# EAGLE design MRCS-cpNode-ProMini (EAGLE 7.7.0)
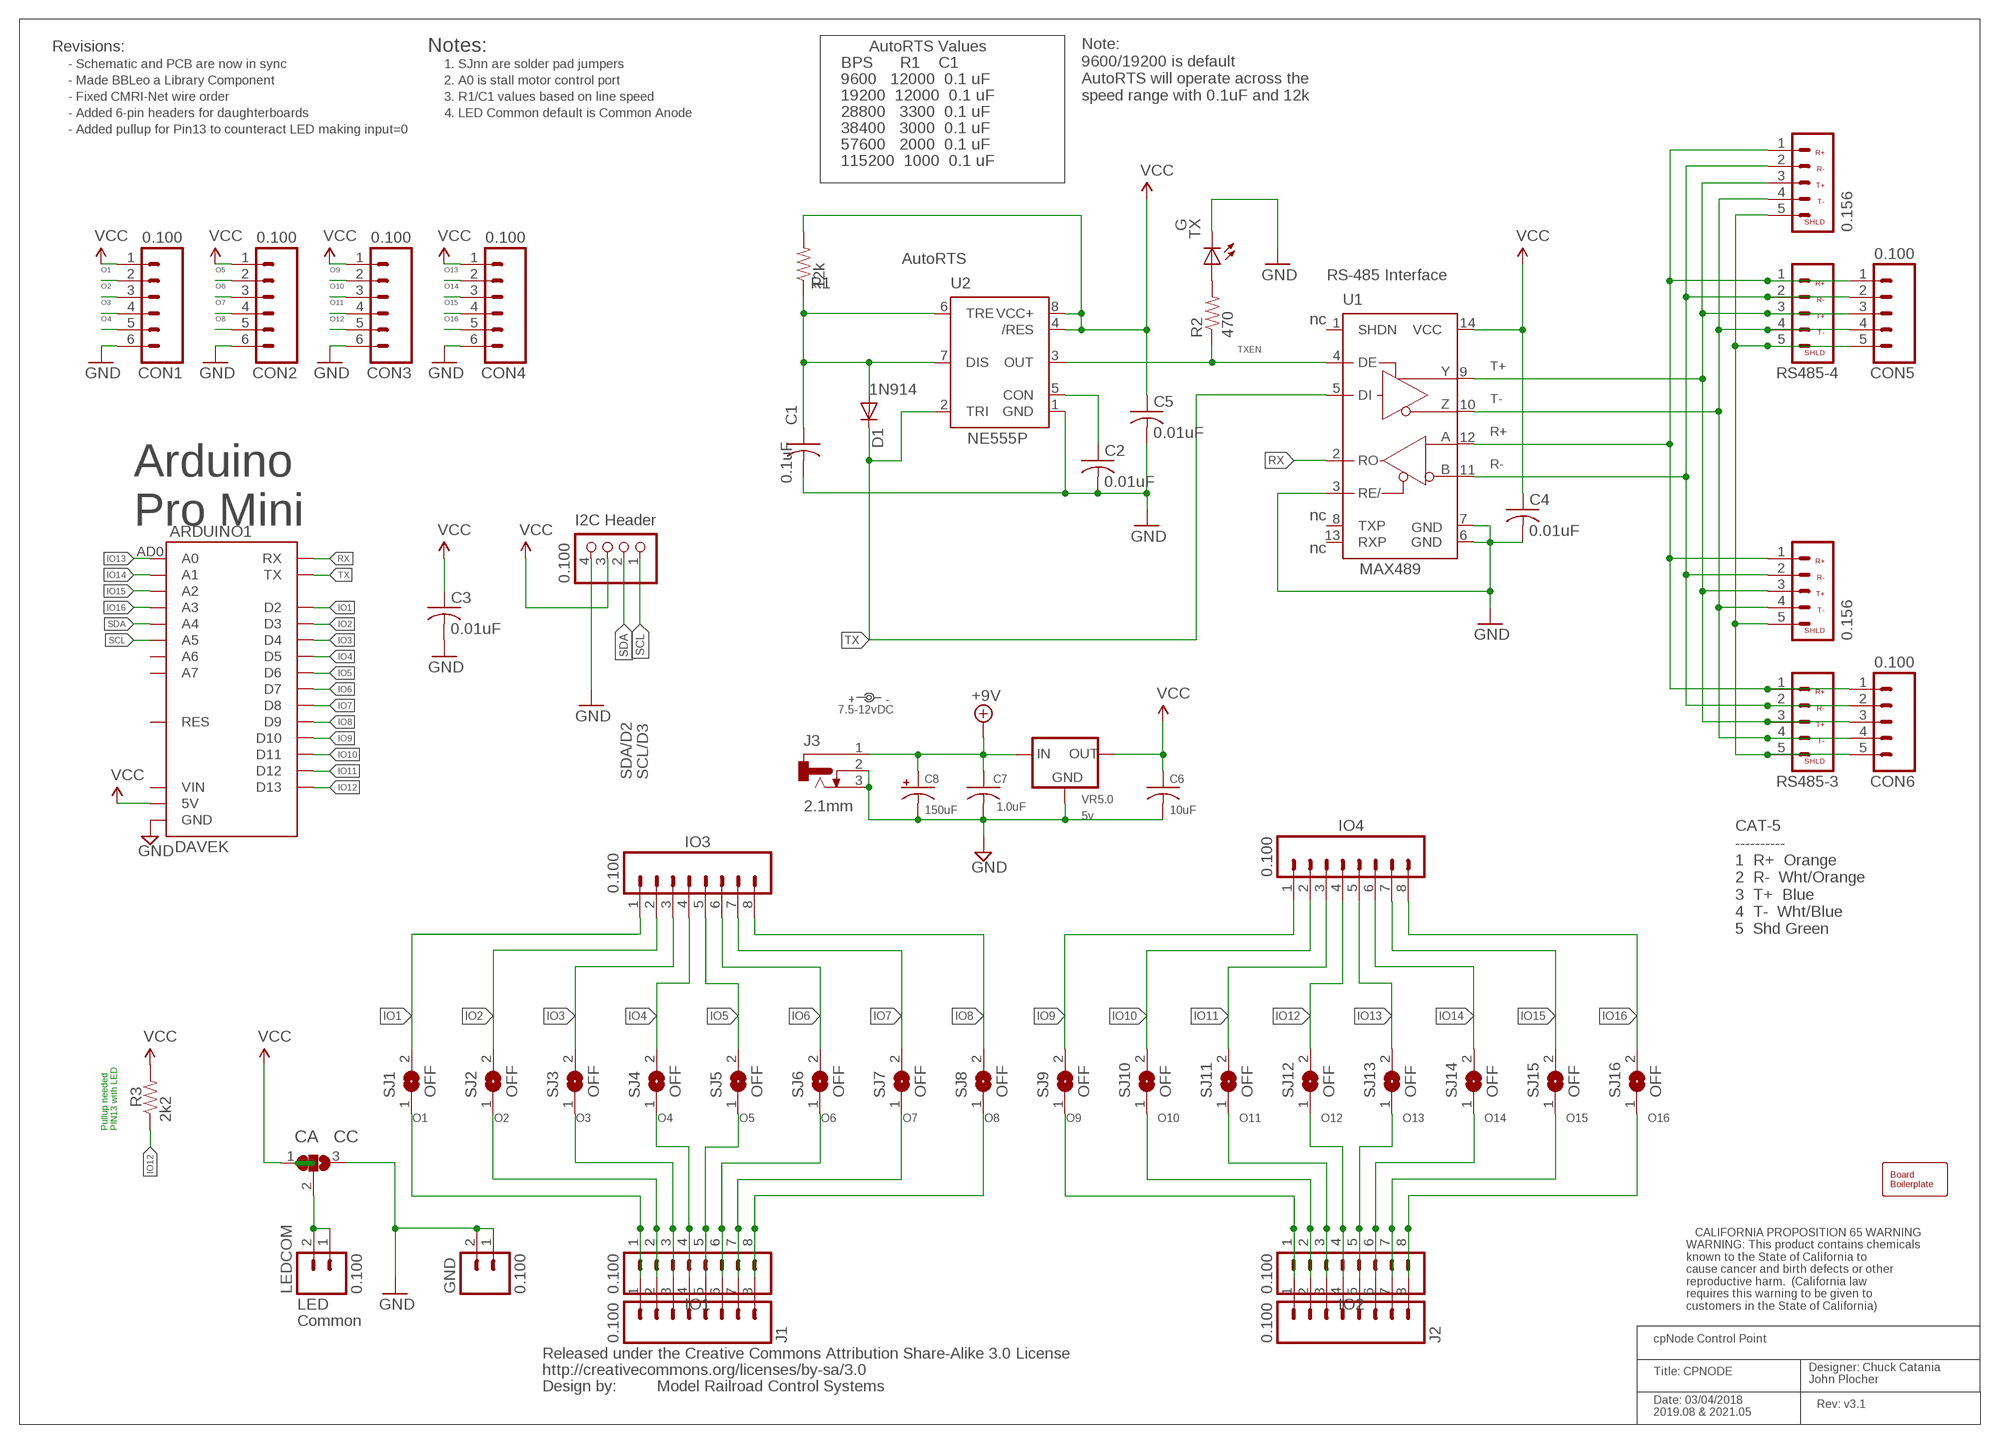
[diagram p0: schematic, sheet 1]

## Parts
ARDUINO1  DAVEK  ARDUINO-PRO-MINIDAVESROBOT  [ARDUINO_PRO_MINI_DAVEK]
BOARD1  BOARD  BOARD69X100MRCS  [BOARD-DINRAIL-2.71IN-MRCS]
C1  0.1uF  CAPPTH2  [C-PTH-0.100]
C2  0.01uF  CAPPTH2  [C-PTH-0.100]
C3  0.01uF  CAPPTH2  [C-PTH-0.100]
C4  0.01uF  CAPPTH2  [C-PTH-0.100]
C5  0.01uF  CAPPTH2  [C-PTH-0.100]
C6  10uF  CAPPTH1  [C050-024X044]
C7  1.0uF  CAPPTH1  [C050-024X044]
C8  150uF  CAP-POLPTH-5MM  [E5-10.5]
CON1  0.100  CONNECTOR-M06SIP_LOCK  [1X06-SIP_LOCK]
CON2  0.100  CONNECTOR-M06SIP_LOCK  [1X06-SIP_LOCK]
CON3  0.100  CONNECTOR-M06SIP_LOCK  [1X06-SIP_LOCK]
CON4  0.100  CONNECTOR-M06SIP_LOCK  [1X06-SIP_LOCK]
CON5  0.100  CONNECTOR-M05LOCK  [1X05_LOCK]
CON6  0.100  CONNECTOR-M05LOCK  [1X05_LOCK]
D1  1N4148  DIODE1N4148  [DIODE-1N4148]
GND  0.100  M02POLAR_LOCK  [MOLEX-1X2_LOCK]
I2CHDR  0.100  PINHD-1X4/90  [1X04/90]
IO1  0.100  M081X08  [1X08]
IO2  0.100  M081X08  [1X08]
IO3  0.100  M081X08  [1X08]
IO4  0.100  M081X08  [1X08]
J1  0.100  CONNECTOR-M08LOCK_LONGPADS  [1X08_LOCK_LONGPADS]
J2  0.100  CONNECTOR-M08LOCK_LONGPADS  [1X08_LOCK_LONGPADS]
J3  2.1mm  CONNECTOR-DC-POWER-RA  [DCJ0202]
LABEL1  7.5-12vDC  DOC-POWER_LABEL  [PWR_LABEL]
LEDCOM  0.100  M02POLAR_LOCK  [MOLEX-1X2_LOCK]
P1  CA CC  PAD-SOLDERJUMPER-2WAYT  [3P-SMD-2X4.8]
R1  12k  RPTH04  [AXIAL-0.4-RES]
R2  470  RPTH04  [AXIAL-0.4-RES]
R3  2k2  RPTH04  [AXIAL-0.4-RES]
RS485-1  0.156  CONNECTOR-CMRINET.156  [KK-156-5]
RS485-2  0.156  CONNECTOR-CMRINET.156  [KK-156-5]
RS485-3  3.5mm  CONNECTOR-CMRINET3.5MM  [CMRINET-3.5MM]
RS485-4  3.5mm  CONNECTOR-CMRINET3.5MM  [CMRINET-3.5MM]
SJ1  OFF  SJ  [SJ]
SJ2  OFF  SJ  [SJ]
SJ3  OFF  SJ  [SJ]
SJ4  OFF  SJ  [SJ]
SJ5  OFF  SJ  [SJ]
SJ6  OFF  SJ  [SJ]
SJ7  OFF  SJ  [SJ]
SJ8  OFF  SJ  [SJ]
SJ9  OFF  SJ  [SJ]
SJ10  OFF  SJ  [SJ]
SJ11  OFF  SJ  [SJ]
SJ12  OFF  SJ  [SJ]
SJ13  OFF  SJ  [SJ]
SJ14  OFF  SJ  [SJ]
SJ15  OFF  SJ  [SJ]
SJ16  OFF  SJ  [SJ]
TX  G  LEDLED3MM  [LED3MM]
U1  MAX3465CPD  [DIL14]
U2  NE555P  [DIL-08]
U$1  CREATIVE_COMMONS  [CREATIVE_COMMONS]
U$2  Prop65  CA-PROP65WARNING  [CA-PROP65WARNING]
VR5.0  5v  VREG-PTH-RA-  [TO-220-RA]

## Nets
+9V [Feed]: C7.1 C8.+ J3.1 VR5.0.IN
GND: ARDUINO1.GND@1(GND) ARDUINO1.GND@2(GND) ARDUINO1.GND@4(GND) C1.2 C2.2 C3.2 C4.2 C5.2 C6.2 C7.2 C8.- CON1.6 CON2.6 CON3.6 CON4.6 GND.1 GND.2 I2CHDR.4 J3.2 J3.3 P1.3 TX.K(C) U1.3(RE/) U1.6(GND) U1.7(GND) U2.1(GND) VR5.0.GND
IO1: ARDUINO1.D2 IO3.1 SJ1.2
IO2: ARDUINO1.D3 IO3.2 SJ2.2
IO3: ARDUINO1.D4 IO3.3 SJ3.2
IO4: ARDUINO1.D5 IO3.4 SJ4.2
IO5: ARDUINO1.D6 IO3.5 SJ5.2
IO6: ARDUINO1.D7 IO3.6 SJ6.2
IO7: ARDUINO1.D8 IO3.7 SJ7.2
IO8: ARDUINO1.D9 IO3.8 SJ8.2
IO9: ARDUINO1.D10 IO4.1 SJ9.2
IO10: ARDUINO1.D11 IO4.2 SJ10.2
IO11: ARDUINO1.D12 IO4.3 SJ11.2
IO12: ARDUINO1.D13 IO4.4 R3.P$1 SJ12.2
IO13: ARDUINO1.AD0(A0) IO4.5 SJ13.2
IO14: ARDUINO1.AD1(A1) IO4.6 SJ14.2
IO15: ARDUINO1.AD2(A2) IO4.7 SJ15.2
IO16: ARDUINO1.AD3(A3) IO4.8 SJ16.2
N$29: R2.P$2 TX.A
N$38: C2.1 U2.5(CON)
N$45: LEDCOM.1 LEDCOM.2 P1.2
N$52: C1.1 D1.A R1.P$1 U2.6(TRE) U2.7(DIS)
O1: CON1.2 IO1.1 J1.1 SJ1.1
O2: CON1.3 IO1.2 J1.2 SJ2.1
O3: CON1.4 IO1.3 J1.3 SJ3.1
O4: CON1.5 IO1.4 J1.4 SJ4.1
O5: CON2.2 IO1.5 J1.5 SJ5.1
O6: CON2.3 IO1.6 J1.6 SJ6.1
O7: CON2.4 IO1.7 J1.7 SJ7.1
O8: CON2.5 IO1.8 J1.8 SJ8.1
O9: CON3.2 IO2.1 J2.1 SJ9.1
O10: CON3.3 IO2.2 J2.2 SJ10.1
O11: CON3.4 IO2.3 J2.3 SJ11.1
O12: CON3.5 IO2.4 J2.4 SJ12.1
O13: CON4.2 IO2.5 J2.5 SJ13.1
O14: CON4.3 IO2.6 J2.6 SJ14.1
O15: CON4.4 IO2.7 J2.7 SJ15.1
O16: CON4.5 IO2.8 J2.8 SJ16.1
R+: CON5.1 CON6.1 RS485-1.1 RS485-2.1 RS485-3.1 RS485-4.1 U1.12(A)
R-: CON5.2 CON6.2 RS485-1.2 RS485-2.2 RS485-3.2 RS485-4.2 U1.11(B)
RX: ARDUINO1.RX U1.2(RO)
SCL [signals]: ARDUINO1.AD5(A5) I2CHDR.1
SDA [signals]: ARDUINO1.AD4(A4) I2CHDR.2
SHIELD: CON5.5 CON6.5 RS485-1.5 RS485-2.5 RS485-3.5 RS485-4.5
T+: CON5.3 CON6.3 RS485-1.3 RS485-2.3 RS485-3.3 RS485-4.3 U1.9(Y)
T-: CON5.4 CON6.4 RS485-1.4 RS485-2.4 RS485-3.4 RS485-4.4 U1.10(Z)
TX: ARDUINO1.TX@1(TX) D1.C U1.5(DI) U2.2(TRI)
TXEN: R2.P$1 U1.4(DE) U2.3(OUT)
VCC: ARDUINO1.5V C3.1 C4.1 C5.1 C6.1 CON1.1 CON2.1 CON3.1 CON4.1 I2CHDR.3 P1.1 R1.P$2 R3.P$2 U1.14(VCC) U2.4(/RES) U2.8(VCC+) VR5.0.OUT
Unconnected: ARDUINO1.AD6(A6) ARDUINO1.AD7(A7) ARDUINO1.RES ARDUINO1.RES@1(RES) ARDUINO1.VIN U1.1(SHDN) U1.8(TXP) U1.13(RXP)

## Notes on the sheet
- Revisions: | Notes: | AutoRTS Values
- - Schematic and PCB are now in sync | 1. SJnn are solder pad jumpers | BPS      R1    C1
- - Made BBLeo a Library Component | 2. A0 is stall motor control port | 9600   12000  0.1 uF
- - Fixed CMRI-Net wire order | 3. R1/C1 values based on line speed | 19200  12000  0.1 uF
- Note: 
  9600/19200 is default
  AutoRTS will operate across the
  speed range with 0.1uF and 12k
- - Added 6-pin headers for daughterboards | 4. LED Common default is Common Anode | 28800   3300  0.1 uF
- - Added pullup for Pin13 to counteract LED making input=0 | 38400   3000  0.1 uF
- 57600   2000  0.1 uF
- 115200  1000  0.1 uF
- AutoRTS
- RS-485 Interface
- nc
- T+
- 1N914
- T-
- R+
- R-
- nc
- Arduino
  Pro Mini
- I2C Header
- nc
- MAX489
- SDA/D2 | SCL/D3
- CAT-5
  ----------
  1  R+  Orange
  2  R-  Wht/Orange
  3  T+  Blue
  4  T-  Wht/Blue
  5  Shd Green
- Pullup needed
  PIN13 with LED
- LED
- Common
- cpNode Control Point
- Title: CPNODE
- Designer: Chuck Catania
  John Plocher
- Model Railroad Control Systems
- Rev: v3.1
- Date: 03/04/2018
  2019.08 & 2021.05

## Library data of the parts
ARDUINO1 = SPCoast:ARDUINO-PRO-MINI
BOARD1 = SPCoast:BOARD
C1-C7 = SPCoast:CAP*
C8 = SPCoast:CAP-POL*
CON1-CON4 = SPCoast:CONNECTOR-M06: Header 6 Standard 6-pin 0.1" header
CON5 CON6 = SPCoast:CONNECTOR-M05: Header 5 Standard 5-pin 0.1" header. Use with straight break away headers (SKU : PRT-00116), right angle break away headers (PRT-00553), swiss pins (PRT-00743), machine pins (PRT-00117), and female headers (PRT-00115). Molex polarized connector foot print use with SKU : PRT-08230 with associated crimp pins and housings.
D1 = SPCoast:DIODE: Diode These are standard reverse protection diodes and small signal diodes. SMA package can handle up to about 1A. SOD-323 can handle about 200mA. What the SOD-323 package when ordering, there are some mfgs out there that are 5-pin packages.
GND LEDCOM = SparkFun:M02: Header 2 Standard 2-pin 0.1" header. Use with straight break away headers (SKU : PRT-00116), right angle break away headers (PRT-00553), swiss pins (PRT-00743), machine pins (PRT-00117), and female headers (PRT-00115). Molex polarized connector foot print use with SKU : PRT-08233 with associated crimp pins and housings.
I2CHDR = pinhead:PINHD-1X4: PIN HEADER
IO1-IO4 = SparkFun:M08: Header 8 Standard 8-pin 0.1" header. Use with straight break away headers (SKU : PRT-00116), right angle break away headers (PRT-00553), swiss pins (PRT-00743), machine pins (PRT-00117), and female headers (PRT-00115).
J1 J2 = SPCoast:CONNECTOR-M08: Header 8 Standard 8-pin 0.1" header. Use with straight break away headers (SKU : PRT-00116), right angle break away headers (PRT-00553), swiss pins (PRT-00743), machine pins (PRT-00117), and female headers (PRT-00115).
J3 = SPCoast:CONNECTOR-DC-POWER: DC POWER JACK
LABEL1 = SPCoast:DOC-POWER_LABEL
P1 = Discreter:PAD-SOLDERJUMPER-2WAY: Solder Jumper 2 way solder jumper
R1-R3 = SPCoast:R*: Resistor Basic schematic elements and footprints for 0603, 1206, and PTH 1/10th watt (small) resistors.
RS485-1-RS485-4 = SPCoast:CONNECTOR-CMRINET: CMRINet Top 3.5mm Screw Terminal 5 pos
SJ1-SJ16 = jumper:SJ: SMD solder JUMPER
TX = SPCoast:LED*
U1 = maxim:MAX346*: +5V, Fail-Safe, 40Mbps, Profibus RS-485/RS-422 Transceivers Source: MAX3465-MAX3469.pdf; MPN: MAX3465CPD+; OC_FARNELL: unknown; OC_NEWARK: 42M5444
U2 = SparkFun:NE555: General purpose bipolar Timer; MF: Arrow Electronics; MPN: NE555N; OC_FARNELL: 1467742; OC_NEWARK: 89K1486
U$1 = SparkFun:CREATIVE_COMMONS
U$2 = MRCS-prop65warningTop:CA-PROP65WARNING: CALIFORNIA PROPOSITION 65 WARNING
VR5.0 = SPCoast:VREG-?-*: Voltage Regulator Standard linear regulator. 7805 uses IGO pinout LM1117 uses GOI pinout

## Net classes
0 default: width 0.254 mm, drill 0.5 mm, clearance 0.203 mm
1 Power: width 0.254 mm, drill 0.8 mm, clearance 0.254 mm
2 signals: width 0.254 mm, drill 0.6 mm, clearance 0.254 mm
3 Feed: width 0.762 mm, drill 1.4 mm, clearance 0.254 mm

## Board
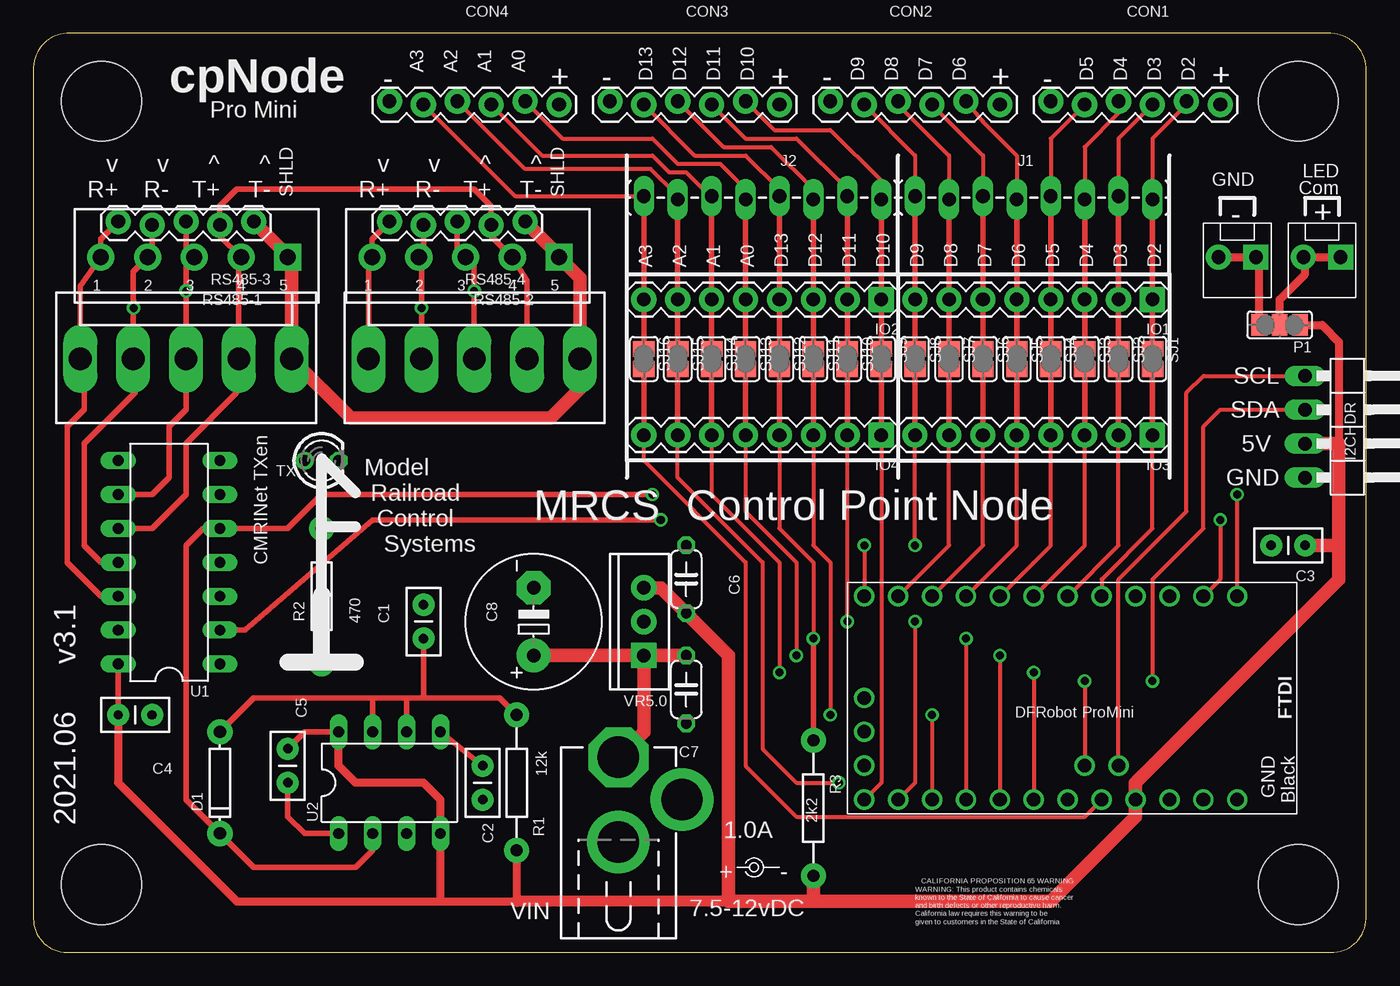
[diagram p1: board, top side]
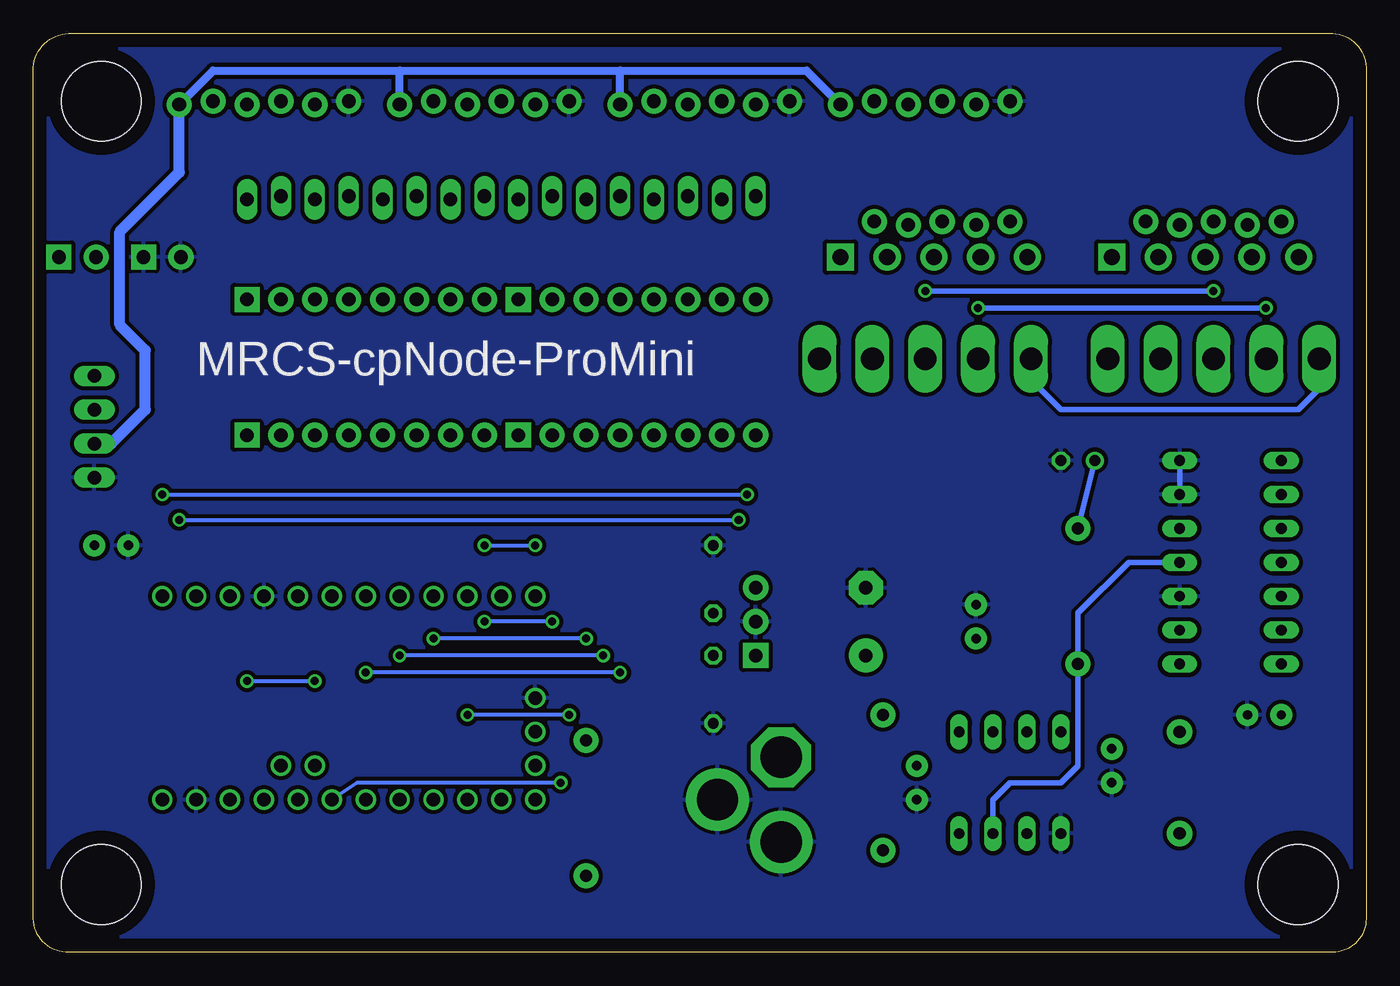
[diagram p2: board, bottom side, seen from below]

Size 99.82 x 68.83 mm. Coordinates in mm from the lower left corner, seen from the top.
Copper layers (1*16): Top 0.035mm / dielectric 1.5mm / Bottom 0.035mm
Design rules "default": minimum track width 10mil, minimum drill 0.6mm, track to track 8mil, track to pad 8mil, pad to pad 8mil, via to via 8mil, smd to smd 8mil, copper to edge 40mil, drill to drill 8mil, minimum pad ring 10mil, minimum via ring 8mil, stop-mask expansion 4mil, vias tented up to drill 0mil, thermal gap 10mil

### Footprints (pad centres in the part's own frame; a part is rotated, then mirrored left to right if it is on the bottom)
ARDUINO_PRO_MINI_DAVEK = drill 1.016: 5V 16.51,21.59; AD0 16.51,11.43; AD1 16.51,13.97; AD2 16.51,16.51; AD3 16.51,19.05; AD4 13.97,17.78; AD5 13.97,20.32; AD6 11.43,1.27; AD7 13.97,1.27; D2 1.27,19.05; D3 1.27,16.51; D4 1.27,13.97; D5 1.27,11.43; D6 1.27,8.89; D7 1.27,6.35; D8 1.27,3.81; D9 1.27,1.27; D10 16.51,1.27; D11 16.51,3.81; D12 16.51,6.35; D13 16.51,8.89; GND@1 16.51,26.67; GND@2 8.89,1.27; GND@4 1.27,21.59; RES 16.51,24.13; RES@1 1.27,24.13; RX 1.27,26.67; TX@1 1.27,29.21; VIN 16.51,29.21
BOARD-DINRAIL-2.71IN-MRCS = hole 6: 94.742,5.08; 5.08,63.754; 94.742,63.754; 5.08,5.08
C-PTH-0.100 = drill 0.7 pad 1.651: 1 -1.27,0; 2 1.27,0
C050-024X044 = drill 0.813 octagon: 1 -2.54,0; 2 2.54,0
E5-10.5 = drill 1.016 pad 2.54: + -2.54,0 | drill 1.016 pad 2.54 octagon: - 2.54,0
1X06-SIP_LOCK = drill 1.016 pad 1.88: 1 0,0; 2 2.54,-0.254; 3 5.08,0; 4 7.62,-0.254; 5 10.16,0; 6 12.7,-0.254
1X05_LOCK = drill 1.016 pad 1.88: 1 0,0.127; 2 2.54,-0.127; 3 5.08,0.127; 4 7.62,-0.127; 5 10.16,0.127
DIODE-1N4148 = drill 0.9 pad 1.88: A 3.81,0; C -3.81,0
MOLEX-1X2_LOCK = drill 1.016 pad 1.88 square: 1 -0.127,0 | drill 1.016 pad 1.88: 2 2.667,0
1X04/90 = drill 1.016 long: 1 -3.81,-3.81; 2 -1.27,-3.81; 3 1.27,-3.81; 4 3.81,-3.81
1X08 = drill 1.016 pad 1.88 square: 1 0,0 | drill 1.016 pad 1.88: 2 2.54,0; 3 5.08,0; 4 7.62,0; 5 10.16,0; 6 12.7,0; 7 15.24,0; 8 17.78,0
1X08_LOCK_LONGPADS = drill 1.016 long: 1 0,0.127; 2 2.54,-0.127; 3 5.08,0.127; 4 7.62,-0.127; 5 10.16,0.127; 6 12.7,-0.127; 7 15.24,0.127; 8 17.78,-0.127
DCJ0202 = drill 3.1 pad 4.5 octagon: 1 0,3.175 | drill 3.1 pad 4.7: 2 4.763,0; 3 0,-3.175
3P-SMD-2X4.8 = smd 1.168 x 1.6: 1 -1.524,0; 2 0,0; 3 1.524,0
AXIAL-0.4-RES = drill 0.9 pad 1.88: P$1 -5.08,0; P$2 5.08,0
KK-156-5 = drill 1.7 pad 2.184 long: 1 -7.92,0; 2 -3.96,0; 3 0,0; 4 3.96,0; 5 7.92,0
CMRINET-3.5MM = drill 1.2 pad 2.032: 1 -6.38,0; 2 -2.88,0; 3 0.62,0; 4 4.12,0 | drill 1.2 pad 2.032 square: 5 7.62,0
SJ = smd 1.168 x 1.6: 1 -0.762,0; 2 0.762,0
LED3MM = drill 0.813: A 1.27,0 | drill 0.813 octagon: K -1.27,0
DIL14 = drill 0.813 long: 1 -7.62,-3.81; 2 -5.08,-3.81; 3 -2.54,-3.81; 4 0,-3.81; 5 2.54,-3.81; 6 5.08,-3.81; 7 7.62,-3.81; 8 7.62,3.81; 9 5.08,3.81; 10 2.54,3.81; 11 0,3.81; 12 -2.54,3.81; 13 -5.08,3.81; 14 -7.62,3.81
DIL-08 = drill 0.813 long: 1 -3.81,-3.81; 2 -1.27,-3.81; 3 1.27,-3.81; 4 3.81,-3.81; 5 3.81,3.81; 6 1.27,3.81; 7 -1.27,3.81; 8 -3.81,3.81
TO-220-RA = drill 1 pad 1.88: GND 0,0; OUT 2.54,0 | drill 1 pad 1.88 square: IN -2.54,0

### Placement (x,y rotation side)
ARDUINO1  60.96,27.94 270 top
BOARD1  0,0 0 top
C1  29.21,24.77 90 top
C2  33.66,12.7 270 top
C3  93.98,30.48 180 top
C4  7.62,17.78 0 top
C5  19.05,13.97 270 top
C6  48.9,27.94 90 top
C7  48.9,19.68 270 top
C8  37.47,24.77 90 top
CON1  88.9,63.5 180 top
CON2  72.39,63.5 180 top
CON3  55.88,63.5 180 top
CON4  39.37,63.5 180 top
CON5  6.35,54.61 0 top
CON6  26.67,54.61 0 top
D1  13.97,12.7 90 top
GND  91.44,52.07 180 top
I2CHDR  99.06,39.37 270 top
IO1  83.82,48.9 180 top
IO2  63.5,48.9 180 top
IO3  83.82,38.73 180 top
IO4  63.5,38.73 180 top
J1  83.82,56.52 180 top
J2  63.5,56.52 180 top
J3  43.82,11.43 0 top
LABEL1  53.98,6.35 90 top
LEDCOM  97.79,52.07 180 top
P1  93.35,46.99 180 top
R1  36.2,12.7 270 top
R2  21.59,26.67 90 top
R3  58.42,10.79 270 top
RS485-1  11.43,44.45 0 top
RS485-2  33.02,44.45 0 top
RS485-3  11.43,52.07 0 top
RS485-4  31.75,52.07 0 top
SJ1  83.82,44.45 270 top
SJ2  81.28,44.45 270 top
SJ3  78.74,44.45 270 top
SJ4  76.2,44.45 270 top
SJ5  73.66,44.45 270 top
SJ6  71.12,44.45 270 top
SJ7  68.58,44.45 270 top
SJ8  66.04,44.45 270 top
SJ9  63.5,44.45 270 top
SJ10  60.96,44.45 270 top
SJ11  58.42,44.45 270 top
SJ12  55.88,44.45 270 top
SJ13  53.34,44.45 270 top
SJ14  50.8,44.45 270 top
SJ15  48.26,44.45 270 top
SJ16  45.72,44.45 270 top
TX  21.59,36.83 180 top
U1  10.16,29.21 90 top
U2  26.67,12.7 0 top
U$1  17.78,-11.43 0 top  (outside the outline)
U$2  72.39,3.81 0 top
U$3  MRCS  [MRCS-LOGO]  21.59,21.72 0 top
VR5.0  45.72,24.77 90 top

### Tracks (layer width: path | path; a pad name or v marks a point on that pad's centre or on a via)
+9V
  Top 1.016: C7.1 VR5.0.IN | J3.1 45.72,16.51 VR5.0.IN | C8.+ VR5.0.IN
GND
  Top 0.406: 91.82,51.69 GND.1 | C5.2 19.05,10.16 20.32,8.89 U2.1
  Top 0.61: GND.2 GND.1 | P1.3 91.82,51.69
  Bottom 0.406: U1.7 U1.6
  pour Bottom (isolate 0.305): 0,68.58 99.7,68.58 99.7,6.99 99.7,0 0,0
IO1
  Top 0.305: IO3.1 83.82,31.75 80.01,27.94 ARDUINO1.D2
  Top 0.406: SJ1.2 IO3.1
IO2
  Top 0.305: IO3.2 81.28,30.48 ARDUINO1.D3
  Top 0.406: SJ2.2 IO3.2
IO3
  Top 0.305: IO3.3 78.74,30.48 ARDUINO1.D4
  Top 0.406: SJ3.2 IO3.3
IO4
  Top 0.305: IO3.4 76.2,30.48 ARDUINO1.D5
  Top 0.406: SJ4.2 IO3.4
IO5
  Top 0.305: IO3.5 73.66,30.48 ARDUINO1.D6
  Top 0.406: IO3.5 SJ5.2
IO6
  Top 0.305: IO3.6 71.12,30.48 ARDUINO1.D7
  Top 0.406: SJ6.2 IO3.6
IO7
  Top 0.305: IO3.7 68.58,30.48 ARDUINO1.D8
  Top 0.406: SJ7.2 IO3.7
IO8  (via drill 0.6)
  Top 0.305: v66.04,30.48 IO3.8 | v62.23,30.48 ARDUINO1.D9
  Top 0.406: SJ8.2 IO3.8
  Bottom 0.305: v66.04,30.48 v62.23,30.48
IO9
  Top 0.305: IO4.1 63.5,12.7 ARDUINO1.D10
  Top 0.406: SJ9.2 IO4.1
IO10  (via drill 0.6)
  Top 0.305: v60.96,24.77 IO4.2 | v66.04,24.77 66.04,12.7 ARDUINO1.D11
  Top 0.406: SJ10.2 IO4.2
  Bottom 0.305: v60.96,24.77 v66.04,24.77
IO11  (via drill 0.6)
  Top 0.305: v67.31,17.78 ARDUINO1.D12 | IO4.3 58.42,30.48 59.69,29.21 v59.69,17.78
  Top 0.406: SJ11.2 IO4.3
  Bottom 0.305: v59.69,17.78 v67.31,17.78
IO12  (via drill 0.6)
  Top 0.305: v69.85,23.5 ARDUINO1.D13 | IO4.4 55.88,31.75 58.42,29.21 v58.42,23.5
  Top 0.406: SJ12.2 IO4.4 | v58.42,23.5 R3.P$1
  Bottom 0.305: v58.42,23.5 v69.85,23.5
IO13  (via drill 0.6)
  Top 0.305: v72.39,22.23 ARDUINO1.AD0 | IO4.5 53.34,33.02 57.15,29.21 v57.15,22.23
  Top 0.406: SJ13.2 IO4.5
  Bottom 0.305: v57.15,22.23 v72.39,22.23
IO14  (via drill 0.6)
  Top 0.305: v74.93,20.95 ARDUINO1.AD1 | IO4.6 50.8,34.29 55.88,29.21 v55.88,20.95
  Top 0.406: SJ14.2 IO4.6
  Bottom 0.305: v55.88,20.95 v74.93,20.95
IO15  (via drill 0.6)
  Top 0.305: IO4.7 48.26,35.56 54.61,29.21 54.61,15.24 57.15,12.7 v60.33,12.7
  Top 0.406: SJ15.2 IO4.7
  Bottom 0.305: v60.33,12.7 75.57,12.7 ARDUINO1.AD2
IO16
  Top 0.305: IO4.8 45.72,36.83 53.34,29.21 53.34,13.97 57.15,10.16 78.74,10.16 ARDUINO1.AD3
  Top 0.406: SJ16.2 IO4.8
N$29
  Bottom 0.406: TX.A R2.P$2
N$38
  Top 0.406: U2.5 C2.1
N$45
  Top 0.406: 95.25,51.94 LEDCOM.2
  Top 0.61: 94.62,46.99 P1.2 93.35,48.9 95.25,50.8 95.25,51.94 | LEDCOM.2 LEDCOM.1
N$52
  Top 0.406: D1.A 16.51,19.05 25.4,19.05 | 25.4,19.05 27.94,19.05 | 27.94,19.05 U2.6 | U2.7 25.4,19.05 | 29.21,19.05 34.93,19.05 R1.P$1 | C1.1 29.21,19.05 | 29.21,19.05 27.94,19.05
O1
  Top 0.305: CON1.2 86.36,63.5 83.82,60.96 J1.1
  Top 0.406: SJ1.1 IO1.1 J1.1
O2
  Top 0.305: CON1.3 81.28,60.96 J1.2
  Top 0.406: SJ2.1 IO1.2 J1.2
O3
  Top 0.305: CON1.4 81.28,62.87 78.74,60.33 J1.3
  Top 0.406: SJ3.1 IO1.3 J1.3
O4
  Top 0.305: CON1.5 76.2,60.96 J1.4
  Top 0.406: SJ4.1 IO1.4 J1.4
O5
  Top 0.305: CON2.2 71.12,62.23 73.66,59.69 J1.5
  Top 0.406: SJ5.1 IO1.5 J1.5
O6
  Top 0.305: CON2.3 71.12,59.69 J1.6
  Top 0.406: SJ6.1 IO1.6 J1.6
O7
  Top 0.305: CON2.4 64.77,63.5 68.58,59.69 J1.7
  Top 0.406: SJ7.1 IO1.7 J1.7
O8
  Top 0.305: CON2.5 66.04,59.69 J1.8
  Top 0.406: SJ8.1 IO1.8 J1.8
O9
  Top 0.305: CON3.2 55.5,61.59 59.69,61.59 63.5,57.78 J2.1
  Top 0.406: SJ9.1 IO2.1 J2.1
O10
  Top 0.305: CON3.3 53.34,60.96 57.15,60.96 60.96,57.15 J2.2
  Top 0.406: SJ10.1 IO2.2 J2.2
O11
  Top 0.305: CON3.4 51.69,60.33 55.25,60.33 58.42,57.15 J2.3
  Top 0.406: SJ11.1 IO2.3 J2.3
O12
  Top 0.305: CON3.5 49.53,59.69 53.34,59.69 55.88,57.15 J2.4
  Top 0.406: SJ12.1 IO2.4 J2.4
O13
  Top 0.305: CON4.2 39.63,60.96 46.36,60.96 48.26,59.05 51.44,59.05 53.34,57.15 53.34,55.88
  Top 0.406: SJ13.1 IO2.5 53.34,55.88 J2.5
O14
  Top 0.305: CON4.3 38.1,59.69 46.36,59.69 47.63,58.42 48.9,58.42 50.68,56.64 J2.6
  Top 0.406: SJ14.1 IO2.6 J2.6
O15
  Top 0.305: CON4.4 36.83,58.67 46.23,58.67 48.01,56.9 48.01,56.64 J2.7
  Top 0.406: SJ15.1 IO2.7 J2.7
O16
  Top 0.305: CON4.5 36.07,56.64 J2.8
  Top 0.406: SJ16.1 IO2.8 J2.8
R+
  Top 0.406: RS485-2.1 25.1,52.44 RS485-4.1 25.37,53.44 CON6.1 | U1.12 5.08,26.67 2.54,29.21 2.54,39.37 3.81,40.64 3.81,44.15 RS485-1.1 3.51,49.9 RS485-3.1 5.05,53.44 CON5.1
  Bottom 0.406: RS485-1.1 3.51,42.21 5.08,40.64 22.86,40.64 24.77,42.55 24.77,44.12 RS485-2.1
R-  (via drill 0.6)
  Top 0.406: 7.47,49.56 7.47,50.99 RS485-3.2 8.89,52.41 CON5.2 | 7.47,49.56 RS485-1.2 7.62,44.3 7.62,41.91 3.81,38.1 3.81,30.48 5.08,29.21 U1.11 | RS485-2.2 v29.06,48.26 29.06,52.52 RS485-4.2 29.21,52.41 CON6.2 | 7.47,49.56 v7.5,48.26
  Bottom 0.406: v7.5,48.26 v29.06,48.26
RX  (via drill 0.6)
  Top 0.305: v88.9,32.38 88.9,27.94 ARDUINO1.RX
  Top 0.406: U1.2 15.88,24.13 25.4,32.38 v46.99,32.38
  Bottom 0.305: v88.9,32.38 v46.99,32.38
SCL
  Top 0.305: ARDUINO1.AD5 81.28,27.94 86.36,33.02 86.36,41.91 87.63,43.18 I2CHDR.1
SDA  (via drill 0.6)
  Top 0.305: v83.82,20.32 83.82,27.94 87.63,31.75 87.63,39.37 88.9,40.64 I2CHDR.2 | v78.74,20.32 ARDUINO1.AD4
  Bottom 0.305: v83.82,20.32 v78.74,20.32
SHIELD
  Top 0.406: 19.35,52.41 RS485-3.5 19.05,52.2 | RS485-4.5 39.37,52.2
  Top 1.016: 19.35,52.41 RS485-1.5 23.8,40.01 38.74,40.01 40.94,42.21 RS485-2.5 40.94,50.5 RS485-4.5 | 19.05,52.2 CON5.5 | 39.37,52.2 CON6.5
  Bottom 1.016: CON5.5 16.64,54.74
T+  (via drill 0.6)
  Top 0.406: RS485-2.3 v33.02,49.53 33.02,51.42 RS485-4.3 31.75,52.69 CON6.3 | U1.9 8.89,34.29 10.16,35.56 10.16,39.37 11.43,40.64 RS485-1.3 v11.43,49.53 11.43,52.09 RS485-3.3 11.43,52.69 CON5.3
  Bottom 0.406: v11.43,49.53 v33.02,49.53
T-
  Top 0.406: 15.39,50.86 15.39,52.55 RS485-3.4 13.97,53.65 CON5.4 13.97,55.88 15.24,57.15 33.02,57.15 34.29,55.88 CON6.4 34.29,53.65 RS485-4.4 36.98,50.33 RS485-2.4 | 15.39,50.86 RS485-1.4 15.24,44.3 15.24,41.91 11.43,38.1 11.43,34.29 8.89,31.75 U1.10 | 15.39,50.86 15.45,50.16
TX  (via drill 0.6)
  Top 0.305: ARDUINO1.TX@1 v90.17,34.29
  Top 0.406: U2.2 25.4,7.62 24.13,6.35 16.51,6.35 D1.C 11.43,11.43 11.43,30.48 12.7,31.75 U1.5 19.05,31.75 21.59,34.29 v46.36,34.29
  Bottom 0.305: v90.17,34.29 v46.36,34.29
TXEN
  Bottom 0.406: U1.4 17.78,29.21 21.59,25.4 R2.P$1 21.59,13.97 22.86,12.7 26.67,12.7 27.94,11.43 U2.3
VCC
  Top 0.406: U1.14 C4.1 | C5.1 20.32,16.51 U2.8
  Top 0.61: P1.1 96.52,46.99 97.79,45.72 97.79,38.1 | C4.1 6.35,12.7 15.24,3.81 30.48,3.81 | 30.48,3.81 36.2,3.81 R1.P$2 | 30.48,3.81 U2.4 30.48,11.43 29.21,12.7 24.13,12.7 22.86,13.97 U2.8
  Top 0.813: 52.07,3.81 36.2,3.81
  Top 1.016: I2CHDR.3 97.79,38.1 97.79,30.48 | C3.1 97.79,30.48 | 58.42,3.81 76.2,3.81 82.55,10.16 ARDUINO1.5V 82.55,12.7 97.79,27.94 97.79,30.48 | 58.42,3.81 52.07,3.81 52.07,22.23 C6.1 46.99,27.3 VR5.0.OUT | R3.P$2 58.42,3.81
  Bottom 0.61: CON1.1 86.36,66.04 72.39,66.04 | 72.39,66.04 55.88,66.04 | 55.88,66.04 41.91,66.04 CON4.1 | CON2.1 72.39,66.04 | CON3.1 55.88,66.04
  Bottom 0.813: I2CHDR.3 93.98,38.1 91.44,40.64 91.44,45.09 93.35,46.99 93.35,53.98 88.9,58.42 CON1.1

### Text on the board
tPlace: A3 | A2 | A1 | A0 | - | + | - | D13 | D12 | D11 | D10 | + | - | D9 | D8 | D7 | D6 | + | - | D5 | D4 | D3 | D2 | + | cpNode | Pro Mini | LED | GND | Com | + | - | A3 | A2 | A1 | A0 | D13 | D12 | D11 | D10 | D9 | D8 | D7 | D6 | D5 | D4 | D3 | D2 | SCL | SDA | CMRINet TXen | 5V | GND | MRCS | Control Point Node | v3.1 | DFRobot ProMini | 2021.06 | 1.0A | VIN
tNames: MRCS
bDocu: Made in the PCR, / Coast Division, NMRA